# Altium schematic sheet Schematic.SchDoc
size A
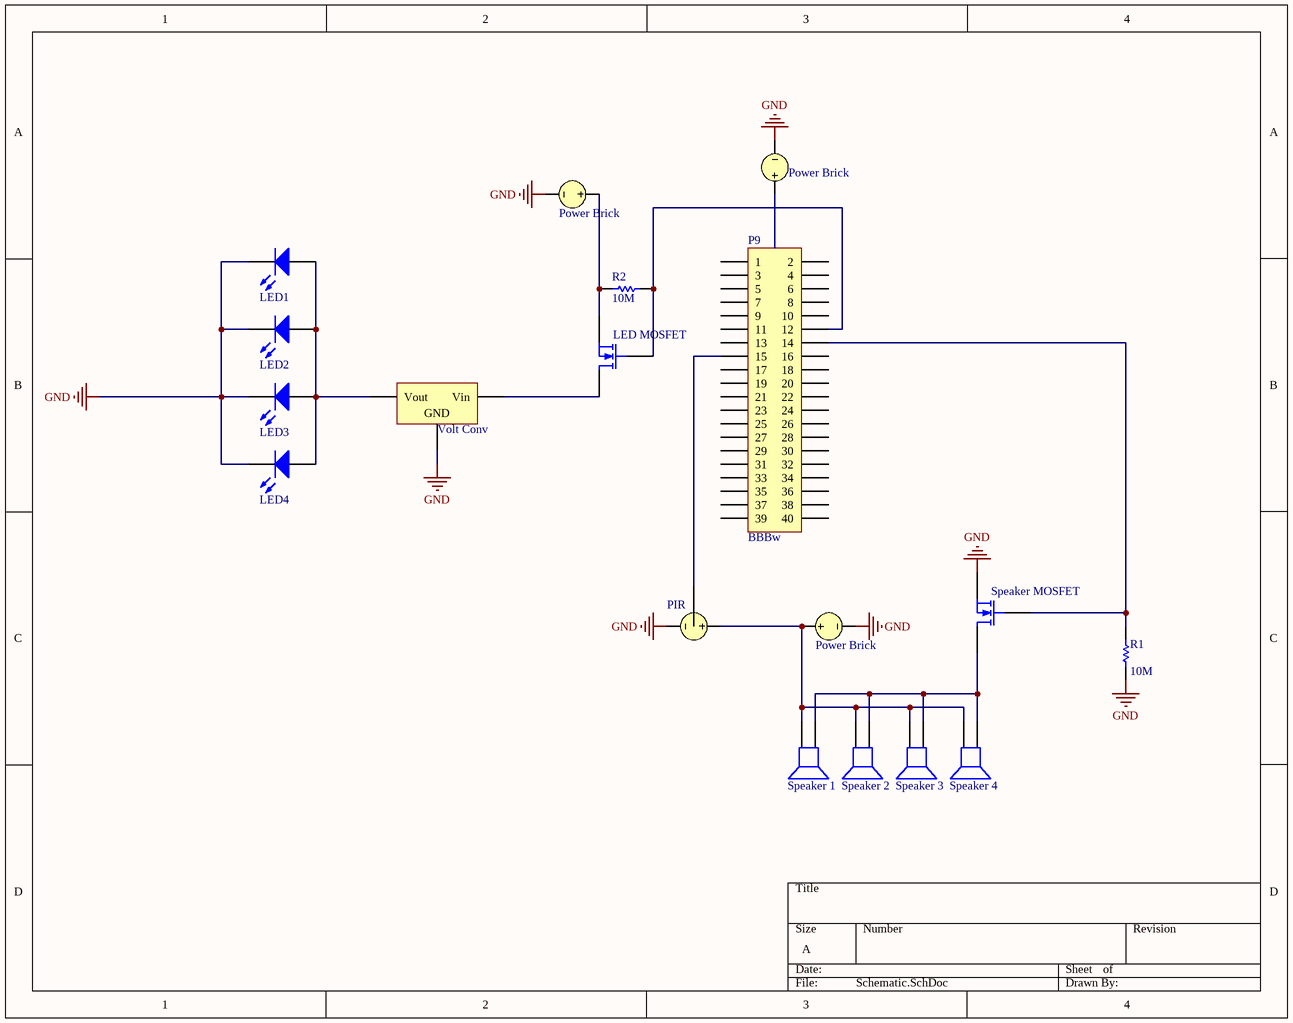
[diagram p0: Schematic.SchDoc]

## Parts
(Parts that share a designator on the sheet are numbered #1, #2 ... from top to bottom, then left to right.)
3  LED3  [LED-0]
D1  LED1  [LED-0]
D2  LED2  [LED-0]
D4  LED4  [LED-0]
P9  BBBw  [MHDR2X20]
Q1  LED MOSFET  [E3]
Q?  Speaker MOSFET  [E3]
R1  value 10M  [AXIAL-0.3]  (hidden comment: Res1)
R2  value 10M  [AXIAL-0.3]  (hidden comment: Res1)
Speaker_1  Speaker1  [PIN2]  (value not drawn)
Speaker_2  Speaker2  [PIN2]  (value not drawn)
Speaker_3  Speaker3  [PIN2]  (value not drawn)
Speaker_4  Speaker4  [PIN2]  (value not drawn)
V  Power Brick
V?#1  Power Brick
V?#2  PIR
V?#3  Power Brick
VC1  Volt Conv  [D2PAK_N]

## Nets
GND: 3.2(K) D1.2(K) D2.2(K) D4.2(K) Q?.3(S) R1.1 V.2 V?#1.2 V?#2.2 V?#3.2 VC1.2(GND)
Net3_1: 3.1(A) D1.1(A) D2.1(A) D4.1(A) VC1.1(Vout)
NetP9_12: P9.12 Q1.2(G) R2.1
NetP9_14: P9.14 Q?.2(G) R1.2
NetP9_15: P9.15 V?#2.3
NetQ1_1: Q1.1(D) VC1.3(Vin)
NetQ1_3: Q1.3(S) R2.2 V.1
NetQ?_1: Q?.1(D) Speaker_1.1 Speaker_2.1 Speaker_3.1 Speaker_4.1
NetSpeaker_1_2: Speaker_1.2 Speaker_2.2 Speaker_3.2 Speaker_4.2 V?#2.1 V?#3.1

Not connected (* = marked no-connect by the designer): P9 1 2 3 4 5 6 7 8 9 10 11 13 16 17 18 19 20 21 22 23 24 25 26 27 28 29 30 31 32 33 34 35 36 37 38 39 40; V?#1 1

## Library data of the parts
3 D1 D2 D4 = LED0: Typical INFRARED GaAs LED; Published: 8-Jun-2000; LatestRevisionDate: 08-Jul-2005; LatestRevisionNote: Mech Layer 1 removed.; PackageReference: LED-0; Publisher: Altium Limited; PackageDescription: LED; 2 Leads
P9 = MHDR2X20: Header, 20-Pin, Dual row; LatestRevisionDate: 17-Jul-2002; LatestRevisionNote: Re-released for DXP Platform.; Publisher: Altium Limited
Q1 Q? = MOSFET-N: N-Channel MOSFET; Published: 8-Jun-2000; LatestRevisionDate: 17-Jul-2002; LatestRevisionNote: Re-released for DXP Platform.; PackageVersion: 1995/1996; PackageReference: E3; Publisher: Altium Limited; PackageDescription: TO, Flat Index; 3 In-Line, Axial Leads; Body Dia. 4.6mm; Lead Dia. 0.5 mm (max)
R1 R2 = Res1: Resistor; Published: 8-Jun-2000; LatestRevisionDate: 17-Jul-2002; LatestRevisionNote: Re-released for DXP Platform.; PackageReference: AXIAL-0.3; Publisher: Altium Limited; PackageDescription: Axial Device, Thru-Hole; 2 Leads; 0.3 in Pin Spacing
Speaker_1-Speaker_4 = Speaker: Loudspeaker; Published: 24-Mar-1999; LatestRevisionDate: 17-Jul-2002; LatestRevisionNote: Re-released for DXP Platform.; PackageReference: PIN2; Publisher: Altium Limited
V V?#1-V?#3 = VSRC: Voltage Source; Note: PCB Footprint - Not required; Published: 8-Jun-2000; LatestRevisionDate: 17-Jul-2002; LatestRevisionNote: Re-released for DXP Platform.; PackageReference: Not Applicable; Publisher: Altium Limited
VC1 = Volt Reg: Voltage Regulator; Published: 24-Mar-1999; LatestRevisionDate: 29-May-2009; LatestRevisionNote: IPC-7351 Footprint Added.; PackageReference: D2PAK; Publisher: Altium Limited; PackageDescription: 3-Pin Transistor Outline Package 2.54 mm Pitch, 15.1 mm Lead Span